# EasyEDA schematic SCH_Rpi.json
TITLE: Sheet_1; REV: 1.0; Date: 2025-05-31; Sheet: 1/1; Drawn By: shehandinusha37; Company: Your Company
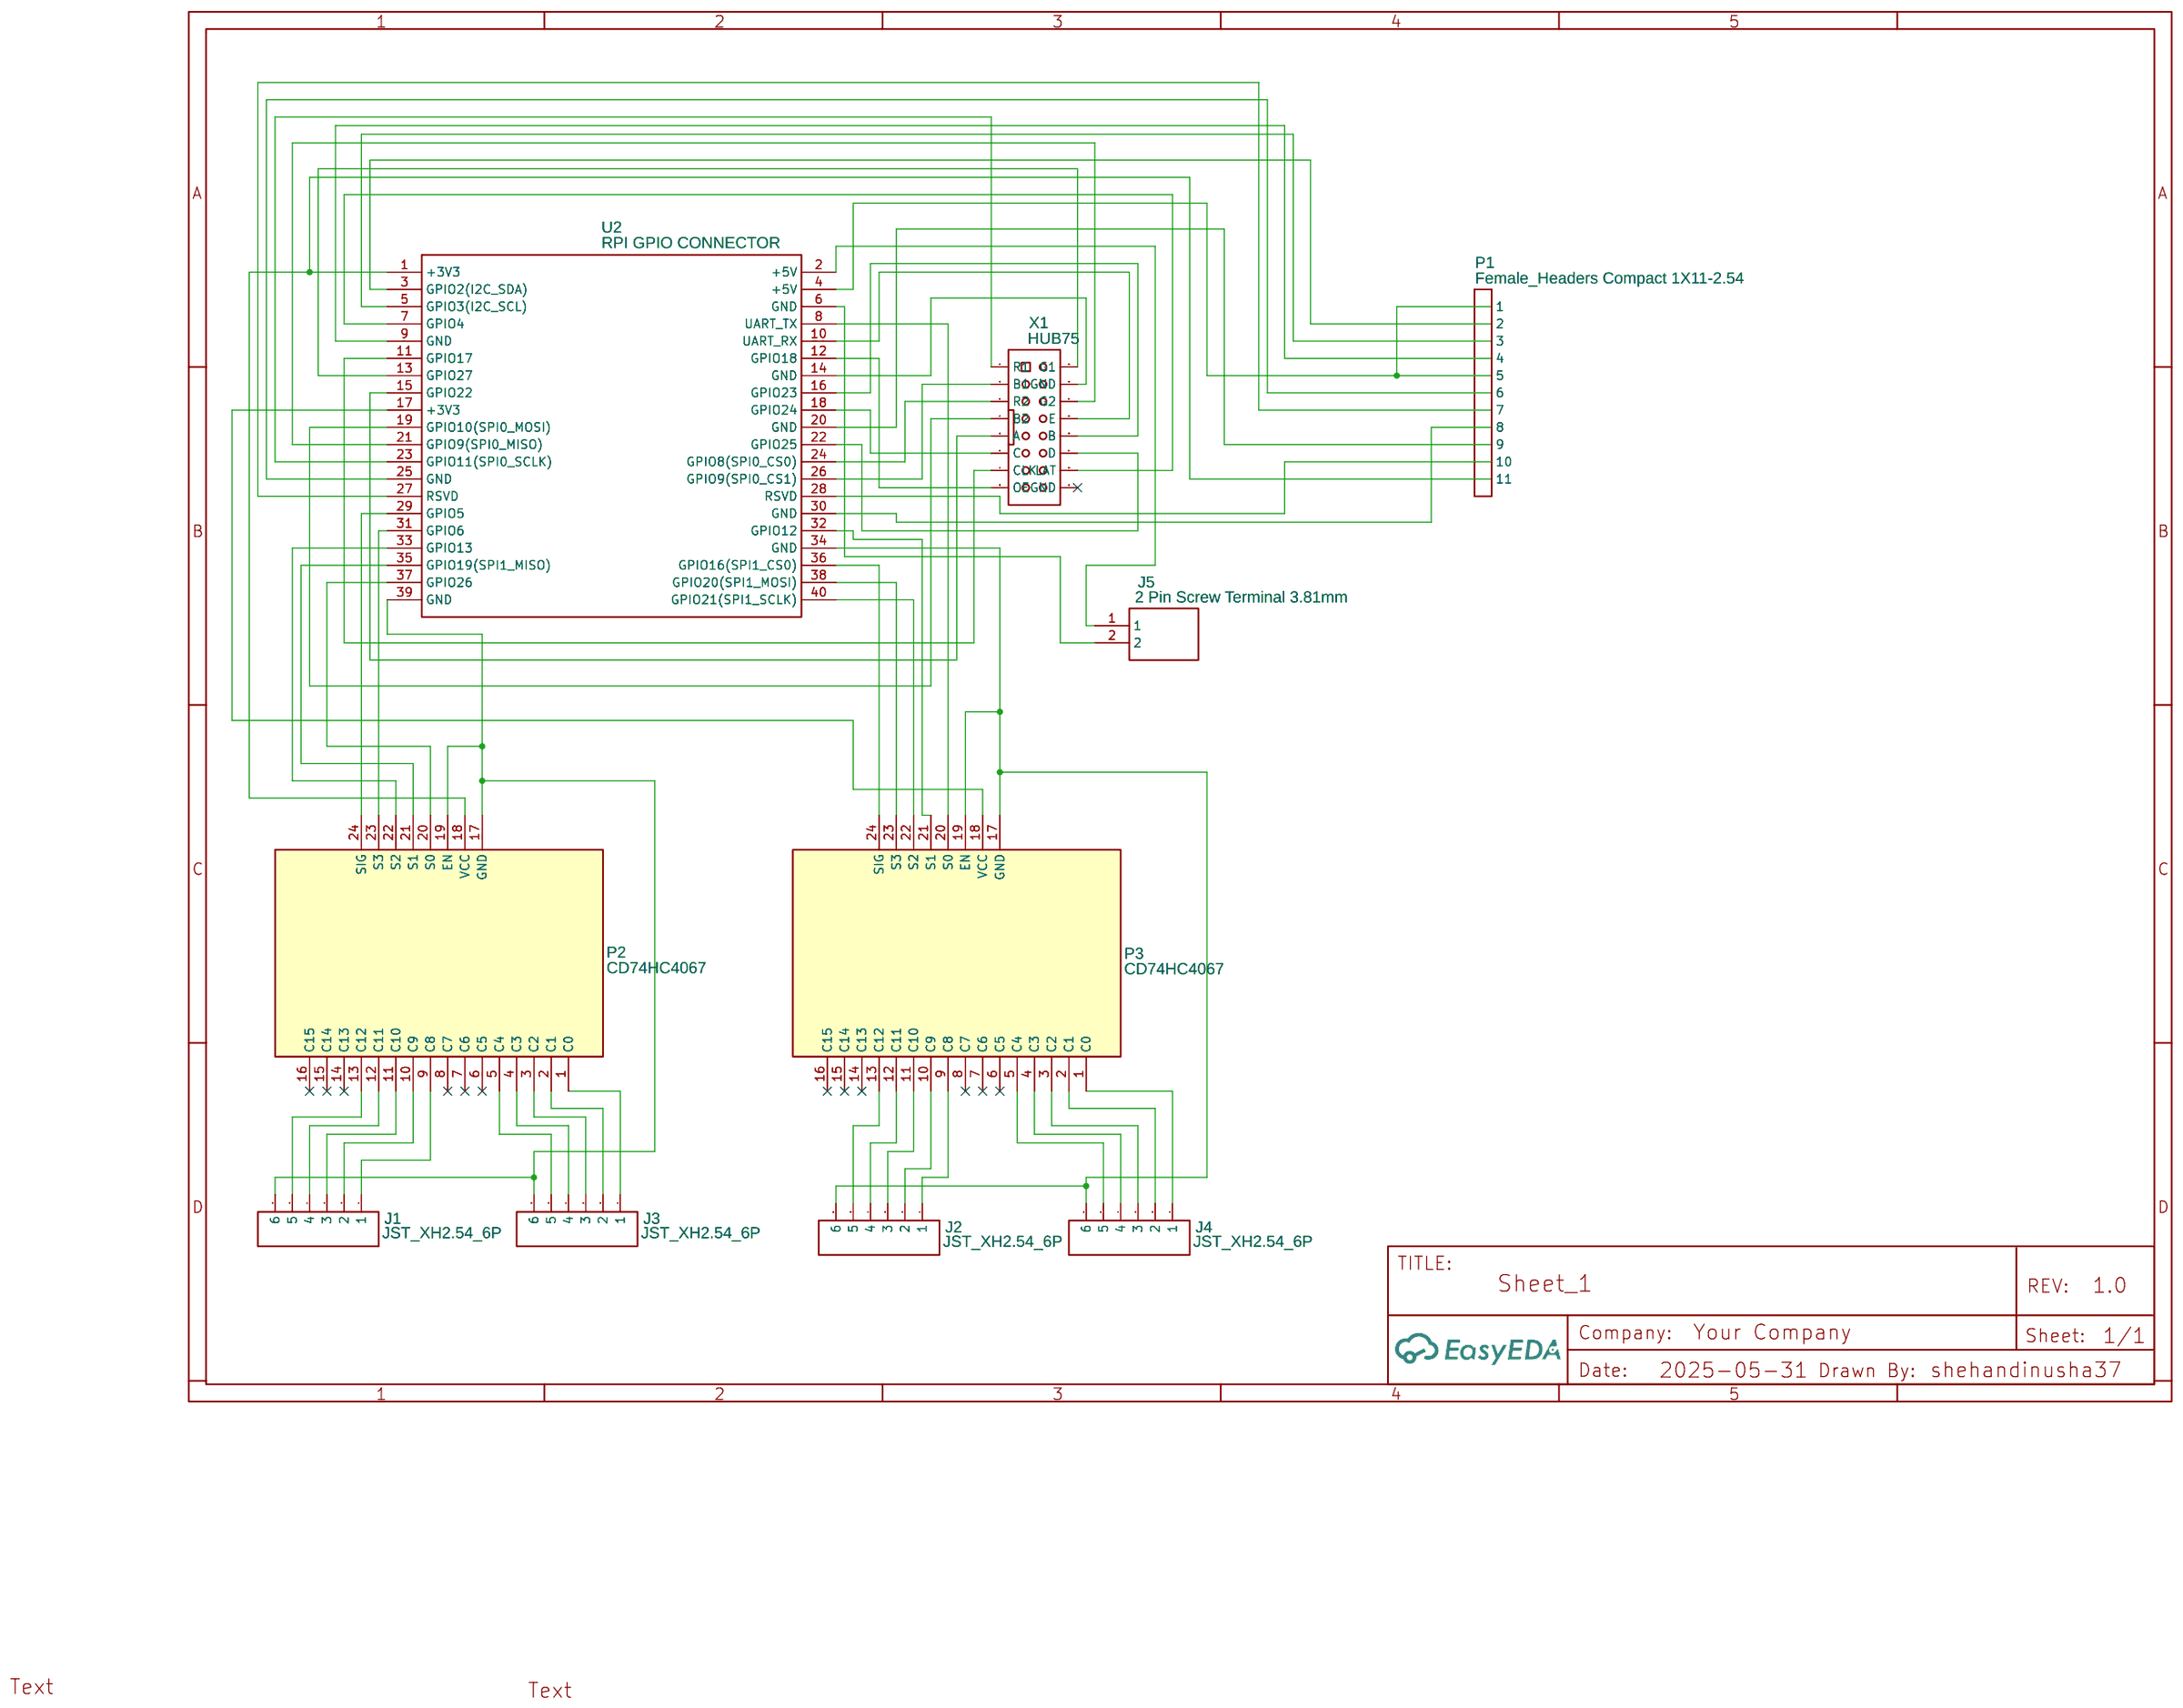
[diagram p0: schematic sheet]

## Parts
J1  JST_XH2.54_6P  [6PIN_2.54_MM_JST_XHP_JST_CONNECTOR_FOR_DC_SOCKET]
J2  JST_XH2.54_6P  [6PIN_2.54_MM_JST_XHP_JST_CONNECTOR_FOR_DC_SOCKET]
J3  JST_XH2.54_6P  [6PIN_2.54_MM_JST_XHP_JST_CONNECTOR_FOR_DC_SOCKET]
J4  JST_XH2.54_6P  [6PIN_2.54_MM_JST_XHP_JST_CONNECTOR_FOR_DC_SOCKET]
J5  2 Pin Screw Terminal 3.81mm  [SCREW_TERMINAL_2PIN_3.81MMPITCH_F0.8]
P1  Female_Headers Compact 1X11-2.54  [FEMALE_HEADERS-1X11]
P2  CD74HC4067  [CD74HC4067]
P3  CD74HC4067  [CD74HC4067]
U2  RPI GPIO CONNECTOR  [RPI_GPIO HEADER]
X1  HUB75  [HUB75]

## Library data of the parts
J1-J4 = JST_XH2.54_6P: Contributor: Андрей Скиффи
J5 = 2 Pin Screw Terminal 3.81mm: Contributor: piazza
P1 = Female_Headers Compact 1X11-2.54: Manufacturer Part: Female Headers 1X11-2.54; Contributor: salvia
P2 P3 = CD74HC4067: sourceId: 1T5FDZYC8; Contributor: Pichuntru
U2 = RPI GPIO CONNECTOR: Supplier: LCSC; Supplier Part: C2977589; Manufacturer: ZHOURI(洲日); Manufacturer Part: 2.54-2*20; link: https://atta.szlcsc.com/upload/public/pdf/source/20220328/834E302BE3C038BBC5C70F5E02589B1E.pdf; Contributor: Muhammad Hasnat; JLCPCB Part Class: Extended Part
X1 = HUB75: Contributor: Amit0710

## Nets
Net-(J1-1): J1.1 P2.9(C8)
Net-(J1-2): J1.2 P2.10(C9)
Net-(J1-3): J1.3 P2.11(C10)
Net-(J1-4): J1.4 P2.12(C11)
Net-(J1-5): J1.5 P2.13(C12)
Net-(J1-6): J1.6 J3.6 P2.17(GND) P2.19(EN) U2.39(GND)
Net-(J2-1): J2.1 P3.9(C8)
Net-(J2-2): J2.2 P3.10(C9)
Net-(J2-3): J2.3 P3.11(C10)
Net-(J2-4): J2.4 P3.12(C11)
Net-(J2-5): J2.5 P3.13(C12)
Net-(J2-6): J2.6 J4.6 P3.17(GND) P3.19(EN) U2.34(GND)
Net-(J3-1): J3.1 P2.1(C0)
Net-(J3-2): J3.2 P2.2(C1)
Net-(J3-3): J3.3 P2.3(C2)
Net-(J3-4): J3.4 P2.4(C3)
Net-(J3-5): J3.5 P2.5(C4)
Net-(J4-1): J4.1 P3.1(C0)
Net-(J4-2): J4.2 P3.2(C1)
Net-(J4-3): J4.3 P3.3(C2)
Net-(J4-4): J4.4 P3.4(C3)
Net-(J4-5): J4.5 P3.5(C4)
Net-(J5-1): J5.1 U2.2(+5V)
Net-(J5-2): J5.2 U2.6(GND)
Net-(P1-1): P1.1 P1.5 U2.4(+5V)
Net-(P1-2): P1.2 U2.3(GPIO2(I2C SDA))
Net-(P1-3): P1.3 U2.5(GPIO3(I2C SCL))
Net-(P1-4): P1.4 U2.9(GND)
Net-(P1-6): P1.6 U2.25(GND)
Net-(P1-7): P1.7 U2.27(RSVD)
Net-(P1-8): P1.8 U2.30(GND)
Net-(P1-9): P1.9 U2.20(GND)
Net-(P1-10): P1.10 U2.28(RSVD)
Net-(P1-11): P1.11 P2.18(VCC) U2.1(+3V3)
Net-(P2-20): P2.20(S0) U2.37(GPIO26)
Net-(P2-21): P2.21(S1) U2.35(GPIO19(SPI1 MISO))
Net-(P2-22): P2.22(S2) U2.33(GPIO13)
Net-(P2-23): P2.23(S3) U2.31(GPIO6)
Net-(P2-24): P2.24(SIG) U2.29(GPIO5)
Net-(P3-18): P3.18(VCC) U2.17(+3V3)
Net-(P3-20): P3.20(S0) U2.8(UART TX)
Net-(P3-21): P3.21(S1) U2.32(GPIO12)
Net-(P3-22): P3.22(S2) U2.40(GPIO21(SPI1 SCLK))
Net-(P3-23): P3.23(S3) U2.38(GPIO20(SPI1 MOSI))
Net-(P3-24): P3.24(SIG) U2.36(GPIO16(SPI1 CS0))
Net-(U2-7): U2.7(GPIO4) X1.10(LAT)
Net-(U2-10): U2.10(UART RX) X1.13(E)
Net-(U2-11): U2.11(GPIO17) X1.7(CLK)
Net-(U2-12): U2.12(GPIO18) X1.8(OE)
Net-(U2-13): U2.13(GPIO27) X1.16(G1)
Net-(U2-14): U2.14(GND) X1.15(GND)
Net-(U2-15): U2.15(GPIO22) X1.5(A)
Net-(U2-16): U2.16(GPIO23) X1.12(B)
Net-(U2-18): U2.18(GPIO24) X1.6(C)
Net-(U2-19): U2.19(GPIO10(SPI0 MOSI)) X1.4(B2)
Net-(U2-21): U2.21(GPIO9(SPI0 MISO)) X1.14(G2)
Net-(U2-22): U2.22(GPIO25) X1.11(D)
Net-(U2-23): U2.23(GPIO11(SPI0 SCLK)) X1.1(R1)
Net-(U2-24): U2.24(GPIO8(SPI0 CS0)) X1.3(R2)
Net-(U2-26): U2.26(GPIO9(SPI0 CS1)) X1.2(B1)

Not connected (* = marked no-connect by the designer): P2 6(C5)* 7(C6)* 8(C7)* 14(C13)* 15(C14)* 16(C15)*; P3 6(C5)* 7(C6)* 8(C7)* 14(C13)* 15(C14)* 16(C15)*; X1 9(GND)*
